# EAGLE design alu1 (EAGLE 5.11)

## Sheet 1 of 3
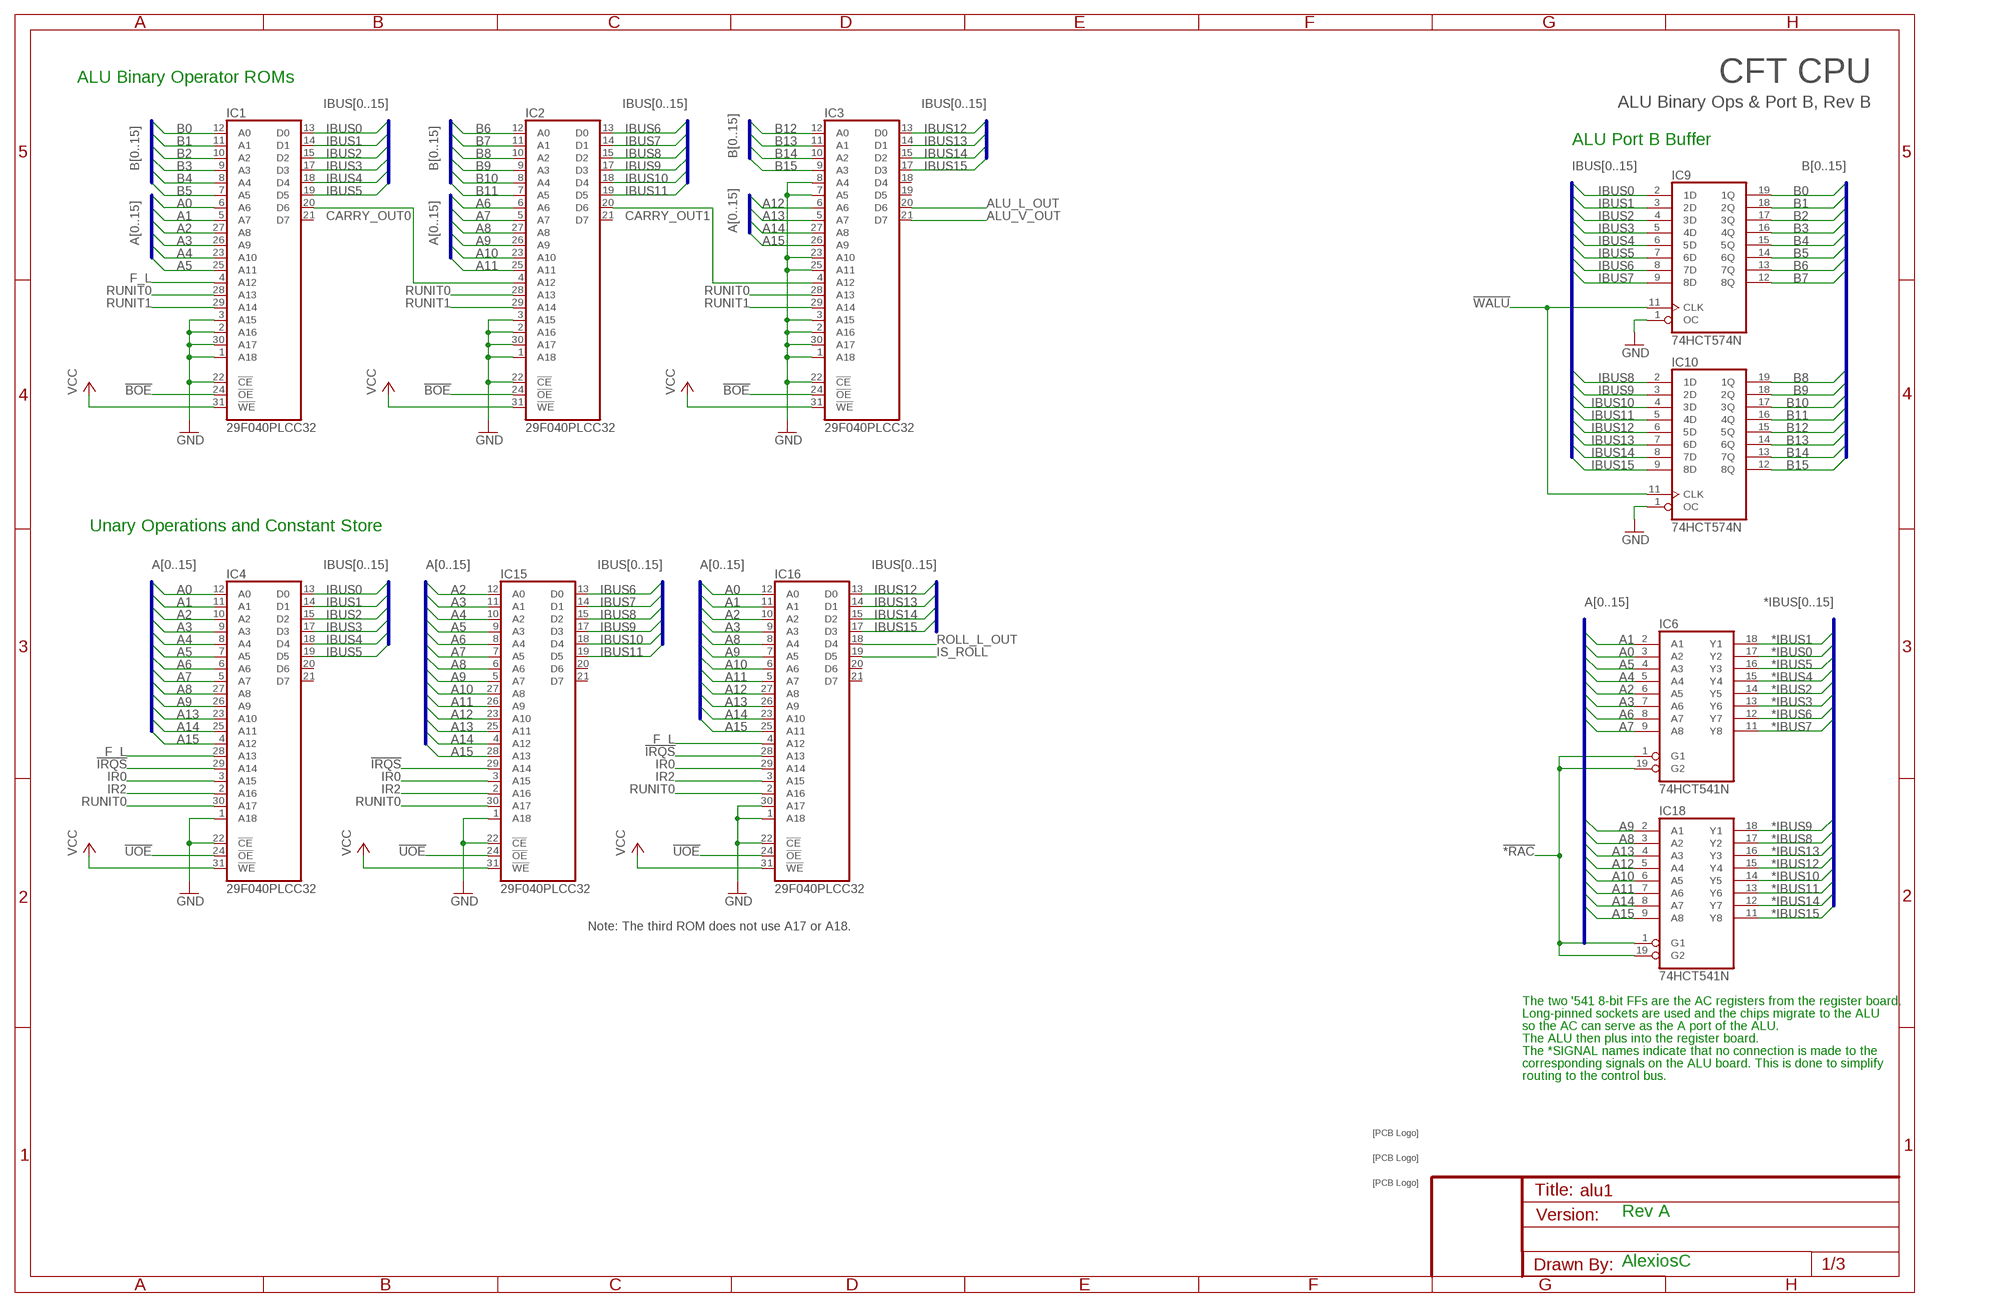
[diagram p0: schematic, sheet 1]

### Parts
IC1  29F040PLCC32  [PLCC32]
IC2  29F040PLCC32  [PLCC32]
IC3  29F040PLCC32  [PLCC32]
IC4  29F040PLCC32  [PLCC32]
IC6  74HCT541N  [DIL20]
IC9  74HCT574N  [DIL20]
IC10  74HCT574N  [DIL20]
IC15  29F040PLCC32  [PLCC32]
IC16  29F040PLCC32  [PLCC32]
IC18  74HCT541N  [DIL20]
U$1  SIGNATUREPLANE  [SIGNATURE_PLANE]
U$2  SIGNATUREPLANE  [SIGNATURE_PLANE]
U$3  SIGNATURESILK  [SIGNATURE]

### Nets
!*RAC: IC6.1(G1) IC6.19(G2) IC18.1(G1) IC18.19(G2)
!BOE: IC1.24(!OE) IC2.24(!OE) IC3.24(!OE) ; also sheet 2
!IRQS: IC4.29(A14) IC15.29(A14) IC16.28(A13) ; also sheet 3
!UOE: IC4.24(!OE) IC15.24(!OE) IC16.24(!OE) ; also sheet 2
!WALU: IC9.11(CLK) IC10.11(CLK) ; also sheet 3
*IBUS0: IC6.17(Y2)
*IBUS1: IC6.18(Y1)
*IBUS2: IC6.14(Y5)
*IBUS3: IC6.13(Y6)
*IBUS4: IC6.15(Y4)
*IBUS5: IC6.16(Y3)
*IBUS6: IC6.12(Y7)
*IBUS7: IC6.11(Y8)
*IBUS8: IC18.17(Y2)
*IBUS9: IC18.18(Y1)
*IBUS10: IC18.14(Y5)
*IBUS11: IC18.13(Y6)
*IBUS12: IC18.15(Y4)
*IBUS13: IC18.16(Y3)
*IBUS14: IC18.12(Y7)
*IBUS15: IC18.11(Y8)
A0: IC1.6(A6) IC4.12(A0) IC6.3(A2) IC16.12(A0)
A1: IC1.5(A7) IC4.11(A1) IC6.2(A1) IC16.11(A1)
A2: IC1.27(A8) IC4.10(A2) IC6.6(A5) IC15.12(A0) IC16.10(A2)
A3: IC1.26(A9) IC4.9(A3) IC6.7(A6) IC15.11(A1) IC16.9(A3)
A4: IC1.23(A10) IC4.8(A4) IC6.5(A4) IC15.10(A2)
A5: IC1.25(A11) IC4.7(A5) IC6.4(A3) IC15.9(A3)
A6: IC2.6(A6) IC4.6(A6) IC6.8(A7) IC15.8(A4)
A7: IC2.5(A7) IC4.5(A7) IC6.9(A8) IC15.7(A5)
A8: IC2.27(A8) IC4.27(A8) IC15.6(A6) IC16.8(A4) IC18.3(A2)
A9: IC2.26(A9) IC4.26(A9) IC15.5(A7) IC16.7(A5) IC18.2(A1)
A10: IC2.23(A10) IC15.27(A8) IC16.6(A6) IC18.6(A5)
A11: IC2.25(A11) IC15.26(A9) IC16.5(A7) IC18.7(A6)
A12: IC3.6(A6) IC15.23(A10) IC16.27(A8) IC18.5(A4)
A13: IC3.5(A7) IC4.23(A10) IC15.25(A11) IC16.26(A9) IC18.4(A3)
A14: IC3.27(A8) IC4.25(A11) IC15.4(A12) IC16.23(A10) IC18.8(A7)
A15: IC3.26(A9) IC4.4(A12) IC15.28(A13) IC16.25(A11) IC18.9(A8)
ALU_L_OUT: IC3.20(D6)
ALU_V_OUT: IC3.21(D7) ; also sheet 2
B0: IC1.12(A0) IC9.19(1Q)
B1: IC1.11(A1) IC9.18(2Q)
B2: IC1.10(A2) IC9.17(3Q)
B3: IC1.9(A3) IC9.16(4Q)
B4: IC1.8(A4) IC9.15(5Q)
B5: IC1.7(A5) IC9.14(6Q)
B6: IC2.12(A0) IC9.13(7Q)
B7: IC2.11(A1) IC9.12(8Q)
B8: IC2.10(A2) IC10.19(1Q)
B9: IC2.9(A3) IC10.18(2Q)
B10: IC2.8(A4) IC10.17(3Q)
B11: IC2.7(A5) IC10.16(4Q)
B12: IC3.12(A0) IC10.15(5Q)
B13: IC3.11(A1) IC10.14(6Q)
B14: IC3.10(A2) IC10.13(7Q)
B15: IC3.9(A3) IC10.12(8Q)
CARRY_OUT0: IC1.20(D6) IC2.4(A12)
CARRY_OUT1: IC2.20(D6) IC3.4(A12)
F_L: IC1.4(A12) IC4.28(A13) IC16.4(A12) ; also sheet 2
GND [Power]: IC1.1(A18) IC1.2(A16) IC1.3(A15) IC1.22(!CE) IC1.30(A17) IC2.1(A18) IC2.2(A16) IC2.3(A15) IC2.22(!CE) IC2.30(A17) IC3.1(A18) IC3.2(A16) IC3.3(A15) IC3.7(A5) IC3.8(A4) IC3.22(!CE) IC3.23(A10) IC3.25(A11) IC3.30(A17) IC4.1(A18) IC4.22(!CE) IC9.1(OC) IC10.1(OC) IC15.1(A18) IC15.22(!CE) IC16.1(A18) IC16.22(!CE) IC16.30(A17) ; also sheet 2,3
IBUS0: IC1.13(D0) IC4.13(D0) IC9.2(1D) ; also sheet 3
IBUS1: IC1.14(D1) IC4.14(D1) IC9.3(2D) ; also sheet 3
IBUS2: IC1.15(D2) IC4.15(D2) IC9.4(3D) ; also sheet 3
IBUS3: IC1.17(D3) IC4.17(D3) IC9.5(4D) ; also sheet 3
IBUS4: IC1.18(D4) IC4.18(D4) IC9.6(5D) ; also sheet 3
IBUS5: IC1.19(D5) IC4.19(D5) IC9.7(6D) ; also sheet 3
IBUS6: IC2.13(D0) IC9.8(7D) IC15.13(D0) ; also sheet 3
IBUS7: IC2.14(D1) IC9.9(8D) IC15.14(D1) ; also sheet 3
IBUS8: IC2.15(D2) IC10.2(1D) IC15.15(D2) ; also sheet 3
IBUS9: IC2.17(D3) IC10.3(2D) IC15.17(D3) ; also sheet 3
IBUS10: IC2.18(D4) IC10.4(3D) IC15.18(D4) ; also sheet 3
IBUS11: IC2.19(D5) IC10.5(4D) IC15.19(D5) ; also sheet 3
IBUS12: IC3.13(D0) IC10.6(5D) IC16.13(D0) ; also sheet 3
IBUS13: IC3.14(D1) IC10.7(6D) IC16.14(D1) ; also sheet 3
IBUS14: IC3.15(D2) IC10.8(7D) IC16.15(D2) ; also sheet 3
IBUS15: IC3.17(D3) IC10.9(8D) IC16.17(D3) ; also sheet 3
IR0: IC4.3(A15) IC15.3(A15) IC16.29(A14) ; also sheet 3
IR2: IC4.2(A16) IC15.2(A16) IC16.3(A15) ; also sheet 3
IS_ROLL: IC16.19(D5) ; also sheet 2
ROLL_L_OUT: IC16.18(D4) ; also sheet 2
RUNIT0: IC1.28(A13) IC2.28(A13) IC3.28(A13) IC4.30(A17) IC15.30(A17) IC16.2(A16) ; also sheet 2,3
RUNIT1: IC1.29(A14) IC2.29(A14) IC3.29(A14) ; also sheet 2,3
VCC [Power]: IC1.31(!WE) IC2.31(!WE) IC3.31(!WE) IC4.31(!WE) IC15.31(!WE) IC16.31(!WE) ; also sheet 2,3
Unconnected: IC1.21(D7) IC2.21(D7) IC3.18(D4) IC3.19(D5) IC4.20(D6) IC4.21(D7) IC15.20(D6) IC15.21(D7) IC16.20(D6) IC16.21(D7)

### Buses
IBUS[0..15]
A[0..15]
B[0..15]
AC[0..15]
*IBUS[0..15]

### Notes on the sheet
- ALU Binary Operator ROMs | CFT CPU
- ALU Binary Ops & Port B, Rev B
- ALU Port B Buffer
- Unary Operations and Constant Store
- Note: The third ROM does not use A17 or A18.
- The two '541 8-bit FFs are the AC registers from the register board.
- Long-pinned sockets are used and the chips migrate to the ALU
- so the AC can serve as the A port of the ALU.
- The ALU then plus into the register board.
- The *SIGNAL names indicate that no connection is made to the
- corresponding signals on the ALU board. This is done to simplify
- routing to the control bus.
- Rev A
- AlexiosC

## Sheet 2 of 3
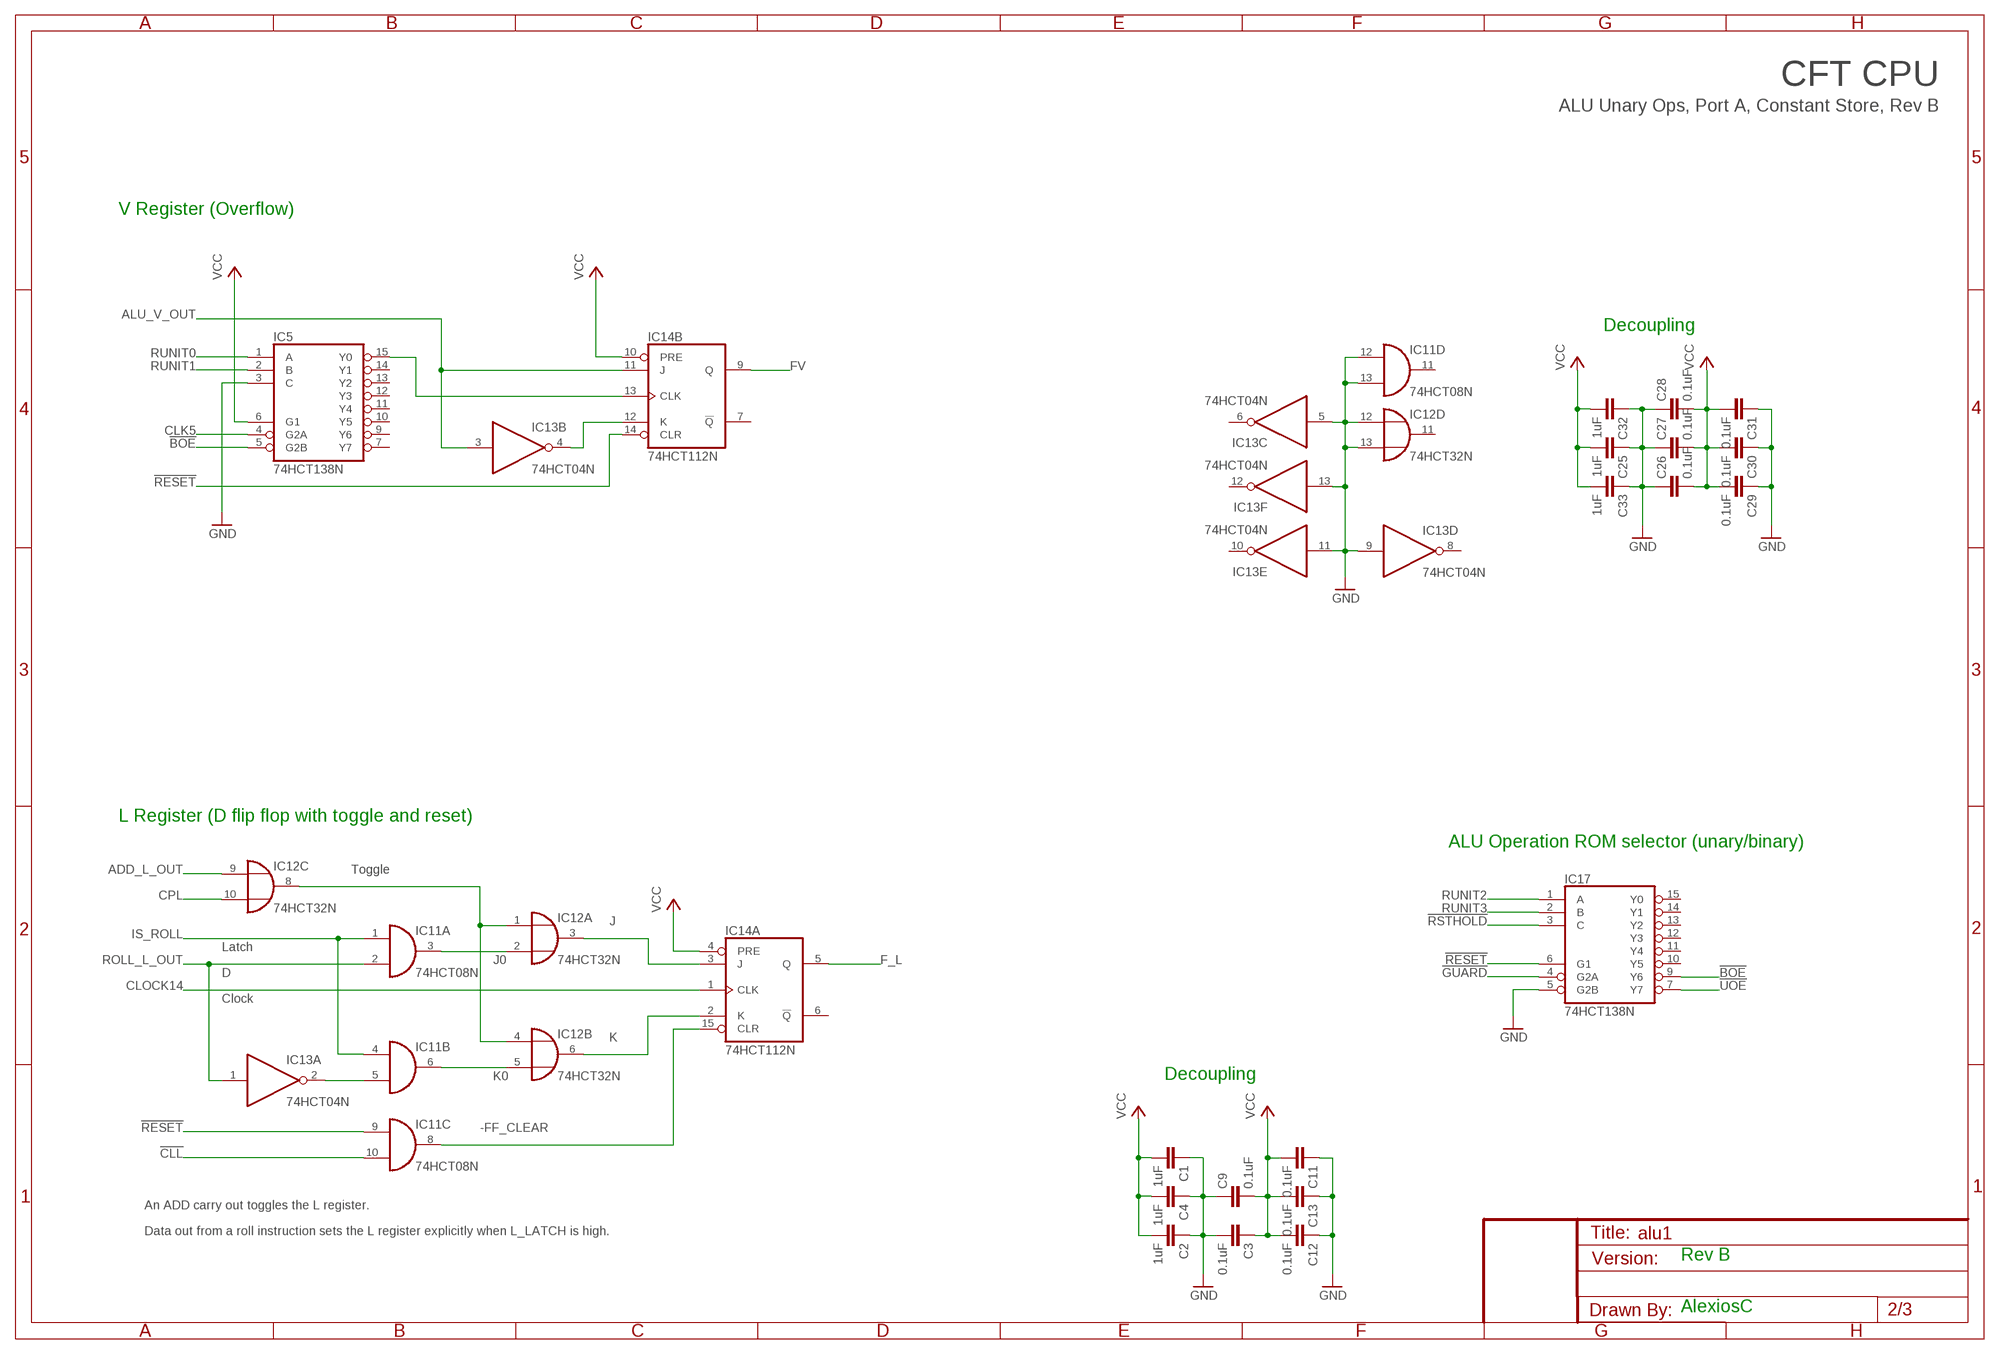
[diagram p1: schematic, sheet 2]

### Parts
C1  1uF  C-EU025-025X050  [C025-025X050]
C2  1uF  C-EU025-025X050  [C025-025X050]
C3  0.1uF  C-EU025-025X050  [C025-025X050]
C4  1uF  C-EU025-025X050  [C025-025X050]
C9  0.1uF  C-EU025-025X050  [C025-025X050]
C11  0.1uF  C-EU025-025X050  [C025-025X050]
C12  0.1uF  C-EU025-025X050  [C025-025X050]
C13  0.1uF  C-EU025-025X050  [C025-025X050]
C25  1uF  C-EU025-025X050  [C025-025X050]
C26  0.1uF  C-EU025-025X050  [C025-025X050]
C27  0.1uF  C-EU025-025X050  [C025-025X050]
C28  0.1uF  C-EU025-025X050  [C025-025X050]
C29  0.1uF  C-EU025-025X050  [C025-025X050]
C30  0.1uF  C-EU025-025X050  [C025-025X050]
C31  0.1uF  C-EU025-025X050  [C025-025X050]
C32  1uF  C-EU025-025X050  [C025-025X050]
C33  1uF  C-EU025-025X050  [C025-025X050]
IC5  74HCT138N  [DIL16]
IC11  74HCT08N  [DIL14]
IC12  74HCT32N  [DIL14]
IC13  74HCT04N  [DIL14]
IC14  74HCT112N  [DIL16]
IC17  74HCT138N  [DIL16]

### Nets
!BOE: IC5.5(G2B) IC17.9(Y6) ; also sheet 1
!CLL: IC11.10(C:I1) ; also sheet 3
!GUARD: IC17.4(G2A) ; also sheet 3
!RESET: IC11.9(C:I0) IC14.14(B:CLR) IC17.6(G1) ; also sheet 3
!RSTHOLD: IC17.3(C) ; also sheet 3
!UOE: IC17.7(Y7) ; also sheet 1
-FF_CLEAR: IC11.8(C:O) IC14.15(A:CLR)
ADD_L_OUT: IC12.9(C:I0)
ALU_V_OUT: IC13.3(B:I) IC14.11(B:J) ; also sheet 1
CLK5: IC5.4(G2A) ; also sheet 3
CLOCK14: IC14.1(A:CLK)
CPL: IC12.10(C:I1)
F_L: IC14.5(A:Q) ; also sheet 1
FV: IC14.9(B:Q) ; also sheet 3
GND [Power]: C1.1 C2.1 C3.2 C4.1 C9.1 C11.1 C12.1 C13.1 C25.1 C26.1 C27.1 C28.1 C29.1 C30.1 C31.1 C32.1 C33.1 IC5.3(C) IC11.12(D:I0) IC11.13(D:I1) IC12.12(D:I0) IC12.13(D:I1) IC13.5(C:I) IC13.9(D:I) IC13.11(E:I) IC13.13(F:I) IC17.5(G2B) ; also sheet 1,3
IS_ROLL: IC11.1(A:I0) IC11.4(B:I0) ; also sheet 1
J: IC12.3(A:O) IC14.3(A:J)
J0: IC11.3(A:O) IC12.2(A:I1)
K: IC12.6(B:O) IC14.2(A:K)
K0: IC11.6(B:O) IC12.5(B:I1)
L_TOGGLE: IC12.1(A:I0) IC12.4(B:I0) IC12.8(C:O)
N$1: IC5.15(Y0) IC14.13(B:CLK)
N$2: IC13.4(B:O) IC14.12(B:K)
N$3: IC11.5(B:I1) IC13.2(A:O)
ROLL_L_OUT: IC11.2(A:I1) IC13.1(A:I) ; also sheet 1
RUNIT0: IC5.1(A) ; also sheet 1,3
RUNIT1: IC5.2(B) ; also sheet 1,3
RUNIT2: IC17.1(A) ; also sheet 3
RUNIT3: IC17.2(B) ; also sheet 3
VCC [Power]: C1.2 C2.2 C3.1 C4.2 C9.2 C11.2 C12.2 C13.2 C25.2 C26.2 C27.2 C28.2 C29.2 C30.2 C31.2 C32.2 C33.2 IC5.6(G1) IC14.4(A:PRE) IC14.10(B:PRE) ; also sheet 1,3
Unconnected: IC5.7(Y7) IC5.9(Y6) IC5.10(Y5) IC5.11(Y4) IC5.12(Y3) IC5.13(Y2) IC5.14(Y1) IC11.11(D:O) IC12.11(D:O) IC13.6(C:O) IC13.8(D:O) IC13.10(E:O) IC13.12(F:O) IC14.6(A:!Q) IC14.7(B:!Q) IC17.10(Y5) IC17.11(Y4) IC17.12(Y3) IC17.13(Y2) IC17.14(Y1) IC17.15(Y0)

### Notes on the sheet
- CFT CPU
- ALU Unary Ops, Port A, Constant Store, Rev B
- V Register (Overflow)
- Decoupling
- L Register (D flip flop with toggle and reset)
- ALU Operation ROM selector (unary/binary)
- Toggle
- Latch
- D
- Clock
- Decoupling
- An ADD carry out toggles the L register.
- Data out from a roll instruction sets the L register explicitly when L_LATCH is high.
- Rev B
- AlexiosC

## Sheet 3 of 3
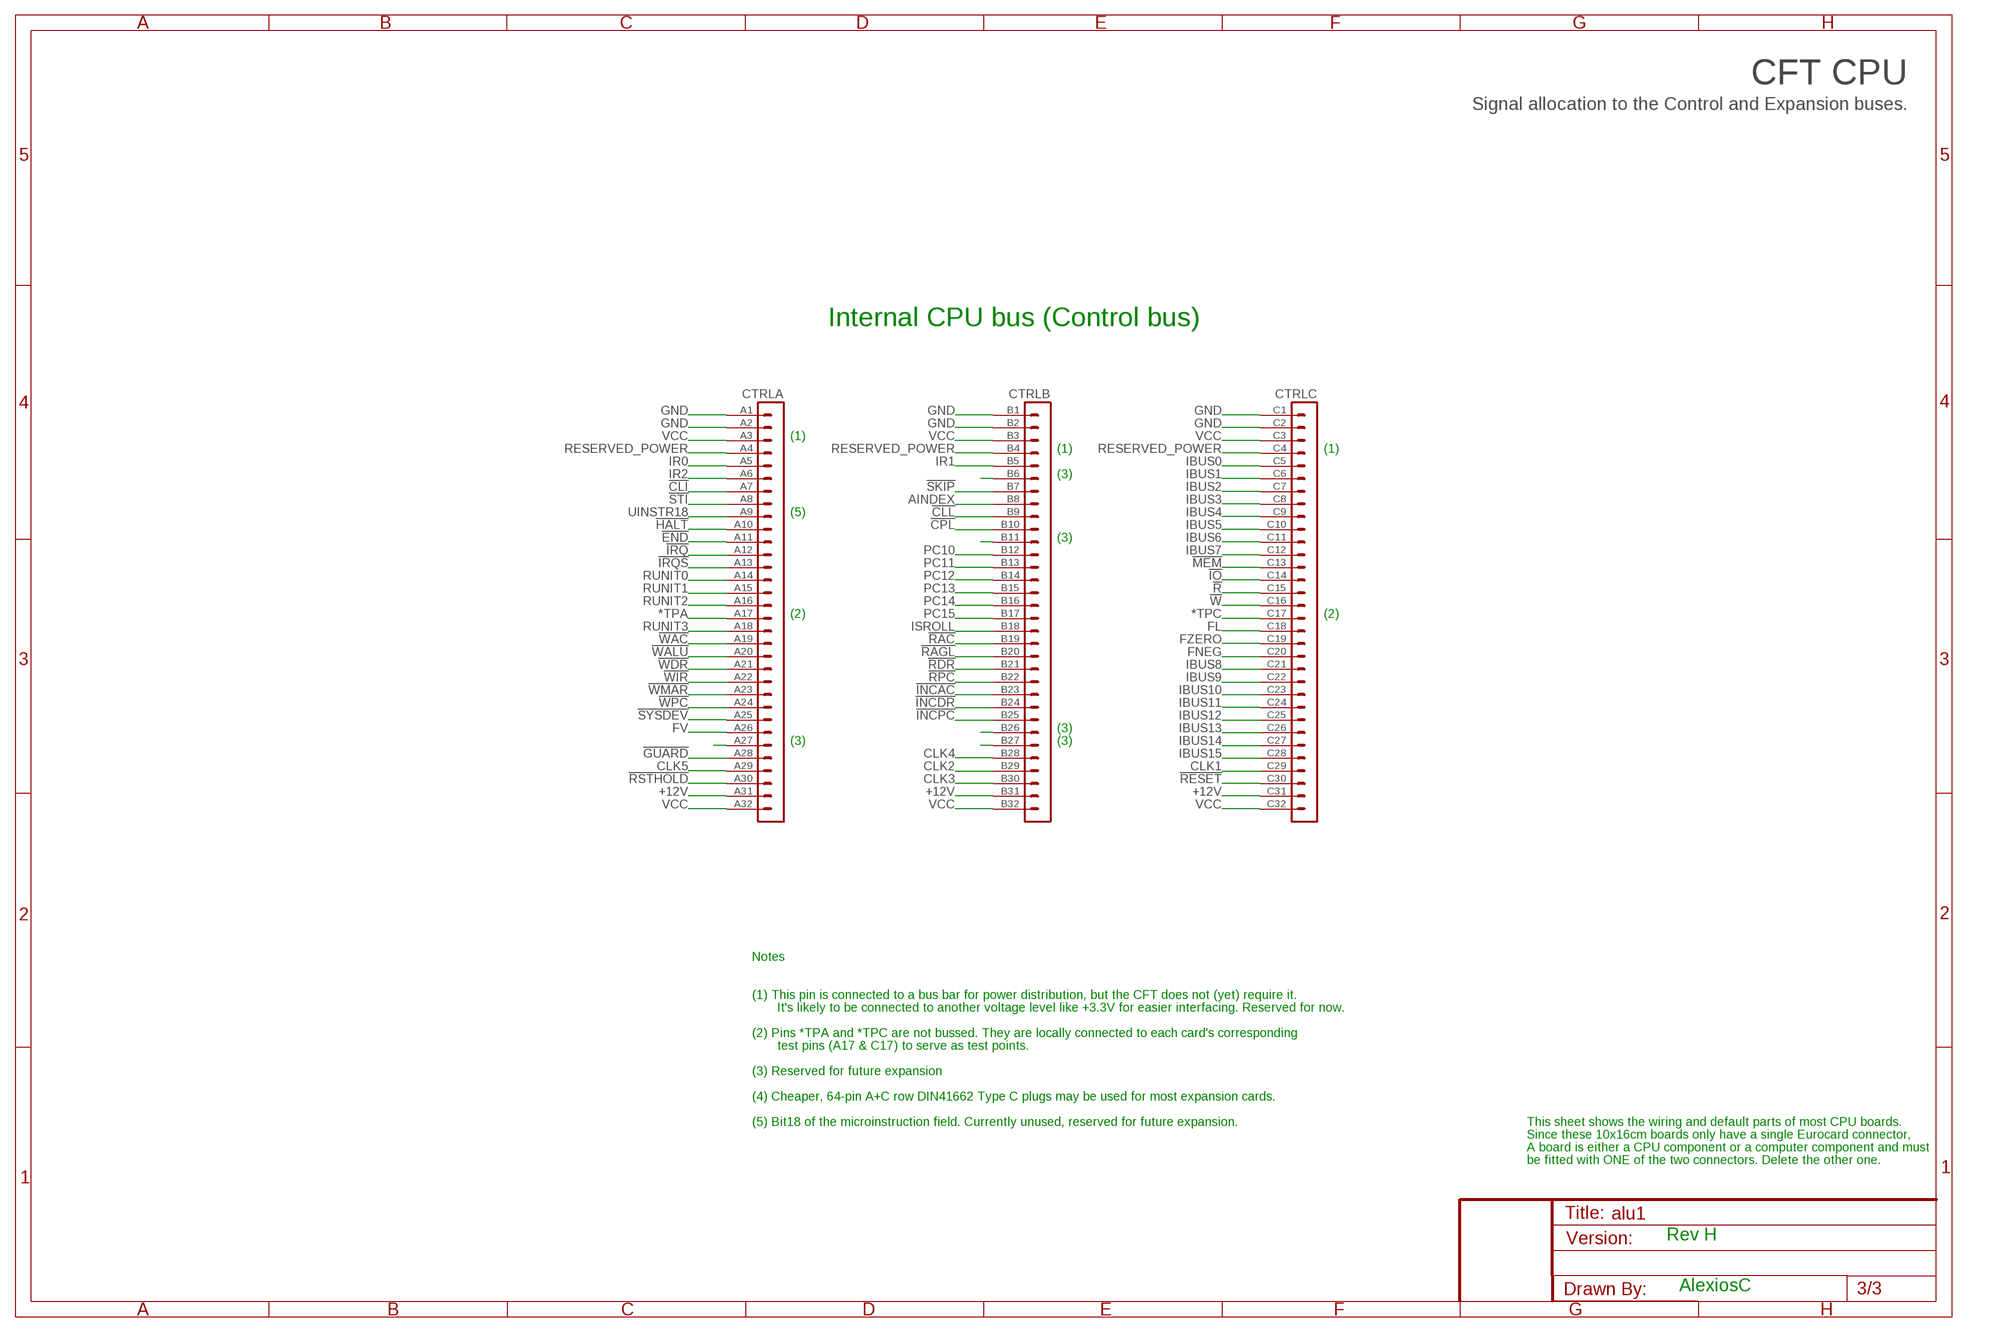
[diagram p2: schematic, sheet 3]

### Parts
CTRL  VG96-3B  [VG96B]

### Nets
!CLI: CTRL.A7
!CLL: CTRL.B9 ; also sheet 2
!CPL: CTRL.B10
!END: CTRL.A11
!GUARD: CTRL.A28 ; also sheet 2
!HALT: CTRL.A10
!INCAC: CTRL.B23
!INCDR: CTRL.B24
!INCPC: CTRL.B25
!IO: CTRL.C14
!IRQ: CTRL.A12
!IRQS: CTRL.A13 ; also sheet 1
!MEM: CTRL.C13
!R: CTRL.C15
!RAC: CTRL.B19
!RAGL: CTRL.B20
!RDR: CTRL.B21
!RESET: CTRL.C30 ; also sheet 2
!RPC: CTRL.B22
!RSTHOLD: CTRL.A30 ; also sheet 2
!SKIP: CTRL.B7
!STI: CTRL.A8
!SYSDEV: CTRL.A25
!W: CTRL.C16
!WAC: CTRL.A19
!WALU: CTRL.A20 ; also sheet 1
!WDR: CTRL.A21
!WIR: CTRL.A22
!WMAR: CTRL.A23
!WPC: CTRL.A24
*TPA: CTRL.A17
*TPC: CTRL.C17
+12V [12V]: CTRL.A31 CTRL.B31 CTRL.C31
AINDEX: CTRL.B8
CLK1: CTRL.C29
CLK2: CTRL.B29
CLK3: CTRL.B30
CLK4: CTRL.B28
CLK5: CTRL.A29 ; also sheet 2
FL: CTRL.C18
FNEG: CTRL.C20
FV: CTRL.A26 ; also sheet 2
FZERO: CTRL.C19
GND [Power]: CTRL.A1 CTRL.A2 CTRL.B1 CTRL.B2 CTRL.C1 CTRL.C2 ; also sheet 1,2
IBUS0: CTRL.C5 ; also sheet 1
IBUS1: CTRL.C6 ; also sheet 1
IBUS2: CTRL.C7 ; also sheet 1
IBUS3: CTRL.C8 ; also sheet 1
IBUS4: CTRL.C9 ; also sheet 1
IBUS5: CTRL.C10 ; also sheet 1
IBUS6: CTRL.C11 ; also sheet 1
IBUS7: CTRL.C12 ; also sheet 1
IBUS8: CTRL.C21 ; also sheet 1
IBUS9: CTRL.C22 ; also sheet 1
IBUS10: CTRL.C23 ; also sheet 1
IBUS11: CTRL.C24 ; also sheet 1
IBUS12: CTRL.C25 ; also sheet 1
IBUS13: CTRL.C26 ; also sheet 1
IBUS14: CTRL.C27 ; also sheet 1
IBUS15: CTRL.C28 ; also sheet 1
IR0: CTRL.A5 ; also sheet 1
IR1: CTRL.B5
IR2: CTRL.A6 ; also sheet 1
ISROLL: CTRL.B18
N$13: CTRL.B27
N$21: CTRL.B6
N$22: CTRL.A27
N$23: CTRL.B26
N$47: CTRL.B11
PC10: CTRL.B12
PC11: CTRL.B13
PC12: CTRL.B14
PC13: CTRL.B15
PC14: CTRL.B16
PC15: CTRL.B17
RESERVED_POWER: CTRL.A4 CTRL.B4 CTRL.C4
RUNIT0: CTRL.A14 ; also sheet 1,2
RUNIT1: CTRL.A15 ; also sheet 1,2
RUNIT2: CTRL.A16 ; also sheet 2
RUNIT3: CTRL.A18 ; also sheet 2
UINSTR18: CTRL.A9
VCC [Power]: CTRL.A3 CTRL.A32 CTRL.B3 CTRL.B32 CTRL.C3 CTRL.C32 ; also sheet 1,2

### Notes on the sheet
- CFT CPU
- Signal allocation to the Control and Expansion buses.
- Internal CPU bus (Control bus)
- (1)
- (1) | (1)
- (3)
- (5)
- (3)
- (2) | (2)
- (3)
- (3) | (3)
- Notes
- (1) This pin is connected to a bus bar for power distribution, but the CFT does not (yet) require it.
- It's likely to be connected to another voltage level like +3.3V for easier interfacing. Reserved for now.
- (2) Pins *TPA and *TPC are not bussed. They are locally connected to each card's corresponding
- test pins (A17 & C17) to serve as test points.
- (3) Reserved for future expansion
- (4) Cheaper, 64-pin A+C row DIN41662 Type C plugs may be used for most expansion cards.
- (5) Bit18 of the microinstruction field. Currently unused, reserved for future expansion. | This sheet shows the wiring and default parts of most CPU boards.
- Since these 10x16cm boards only have a single Eurocard connector,
- A board is either a CPU component or a computer component and must
- be fitted with ONE of the two connectors. Delete the other one.
- Rev H
- AlexiosC

## Power pins joined to a net without a drawn wire
GND: IC1.16(GND) IC2.16(GND) IC3.16(GND) IC4.16(GND) IC5.8(GND) IC6.10(GND) IC9.10(GND) IC10.10(GND) IC11.7(P:GND) IC12.7(P:GND) IC13.7(P:GND) IC14.8(P:GND) IC15.16(GND) IC16.16(GND) IC17.8(GND) IC18.10(GND)
VCC: IC1.32(VCC) IC2.32(VCC) IC3.32(VCC) IC4.32(VCC) IC5.16(VCC) IC6.20(VCC) IC9.20(VCC) IC10.20(VCC) IC11.14(P:VCC) IC12.14(P:VCC) IC13.14(P:VCC) IC14.16(P:VCC) IC15.32(VCC) IC16.32(VCC) IC17.16(VCC) IC18.20(VCC)

## Library data of the parts
C1-C4 C9 C11-C13 C25-C33 = rcl:C-EU: CAPACITOR, European symbol
CTRL = 19inch:VG96-3: PCB EUROCARD, 96-pin type C/ABC, 2.54 mm
IC1-IC4 IC15 IC16 = alexios:29F040: 4-mbit (512x8) Flash memory in a PLCC32 package (with socket). AM29F040 is an example of this.
IC5 IC17 = 74xx-eu:74*138: 3-line to 8-line DECODER/DEMULTIPLEXER
IC6 IC18 = 74xx-eu:74*541: Octal BUFFER and LINE DRIVER, 3-state
IC9 IC10 = 74xx-eu:74*574: 8-bit D type FLIP FLOP bus driver
IC11 = 74xx-eu:74*08: Quad 2-input AND gate
IC12 = 74xx-eu:74*32: Quad 2-input OR gate
IC13 = 74xx-eu:74*04: Hex INVERTER
IC14 = 74xx-eu:74*112: Dual J-K negative edge triggered FLIP FLOP, preset and clear
U$1-U$3 = alexios:SIGNATURE: Soup signature

## Net classes
0 default: width 0.305 mm, clearance 0.305 mm
1 Power: width 0.914 mm, clearance 0.254 mm
2 12V: width 0.635 mm, clearance 0.635 mm

## Board
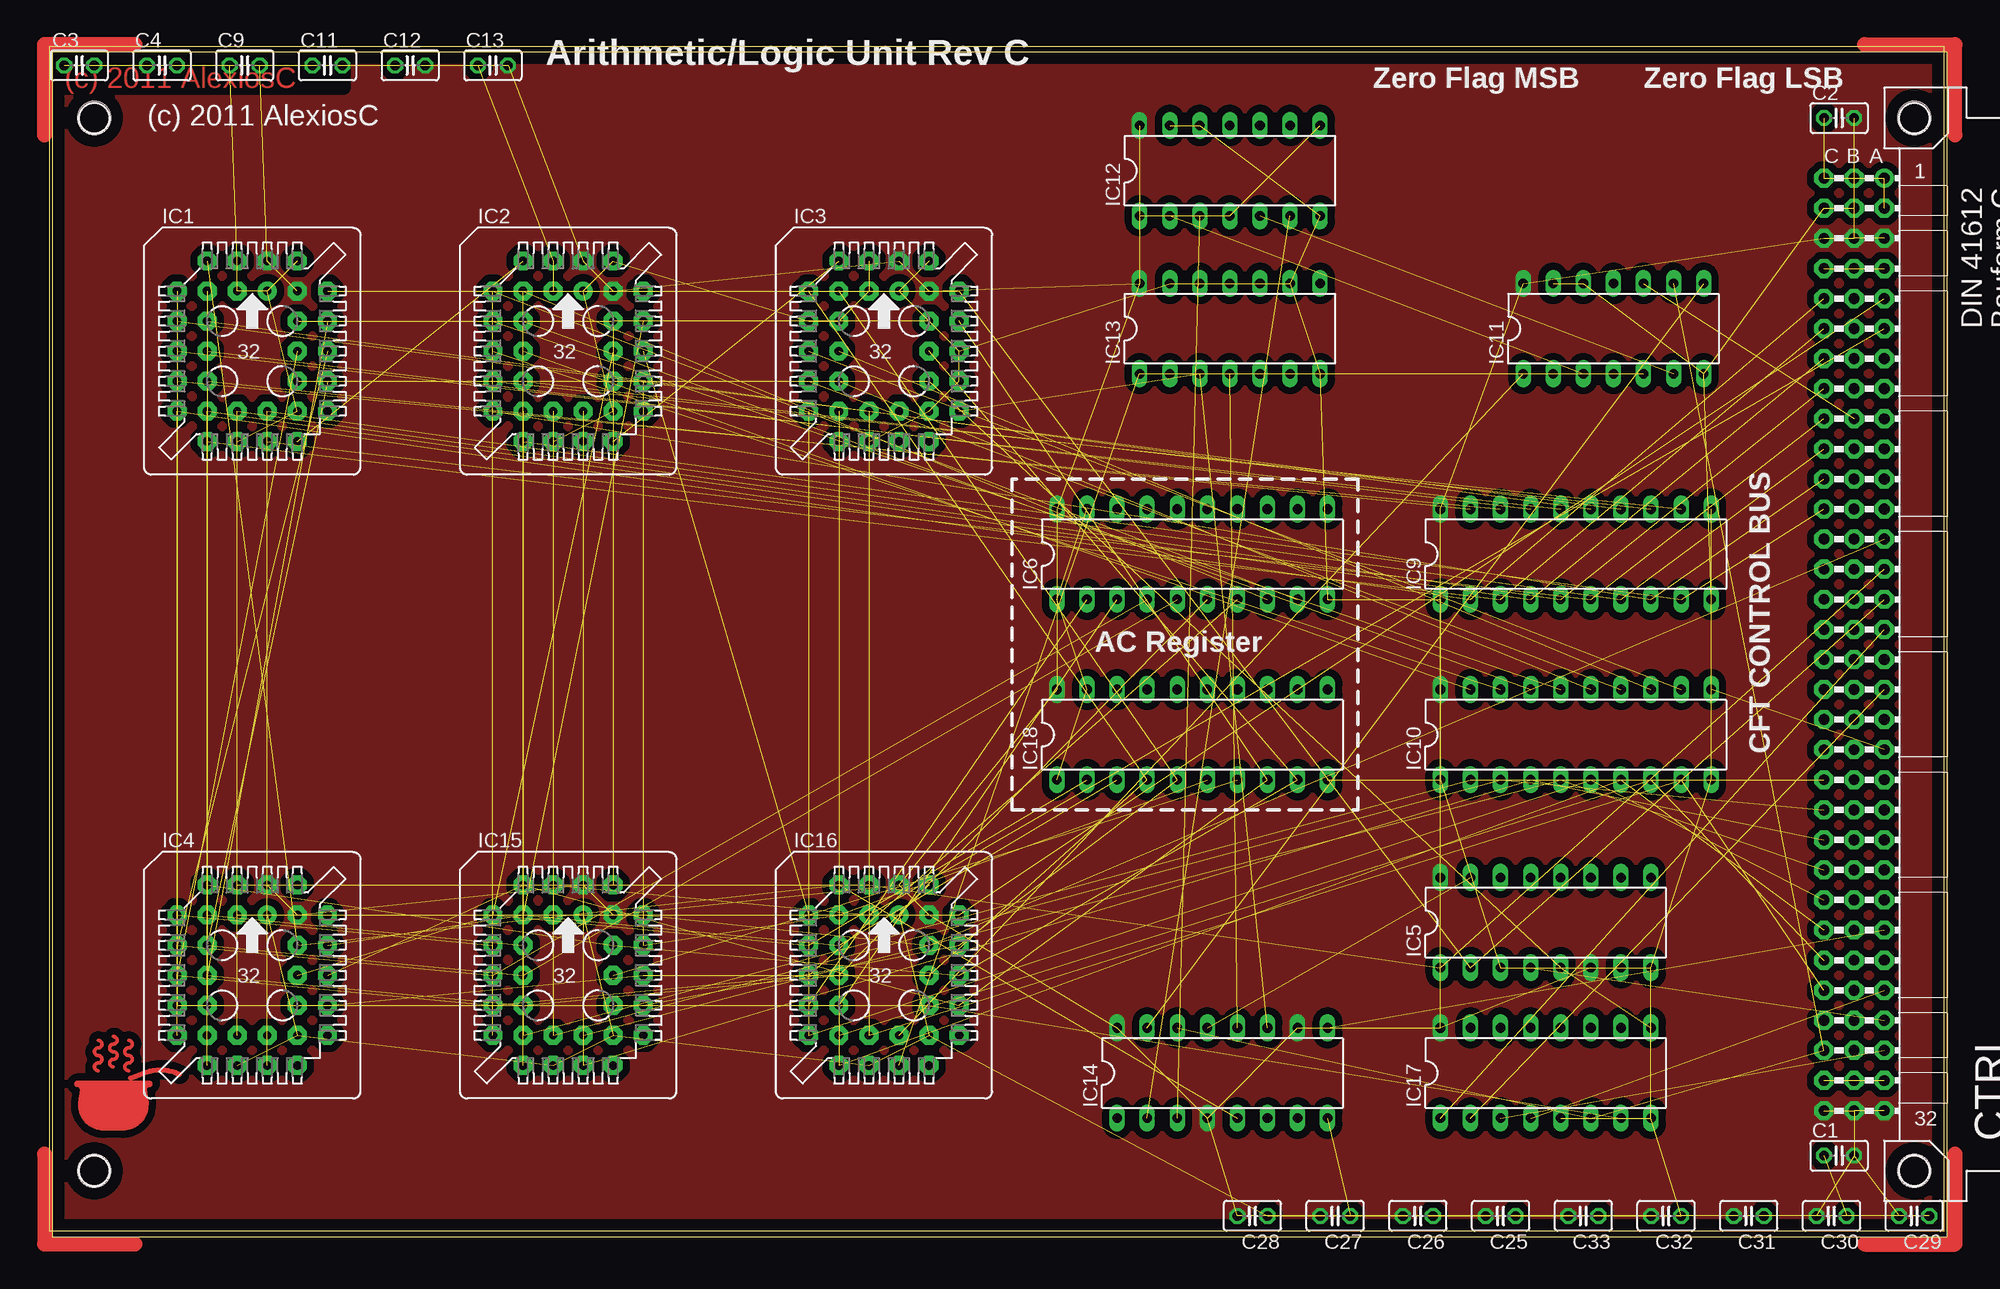
[diagram p3: board, top side]
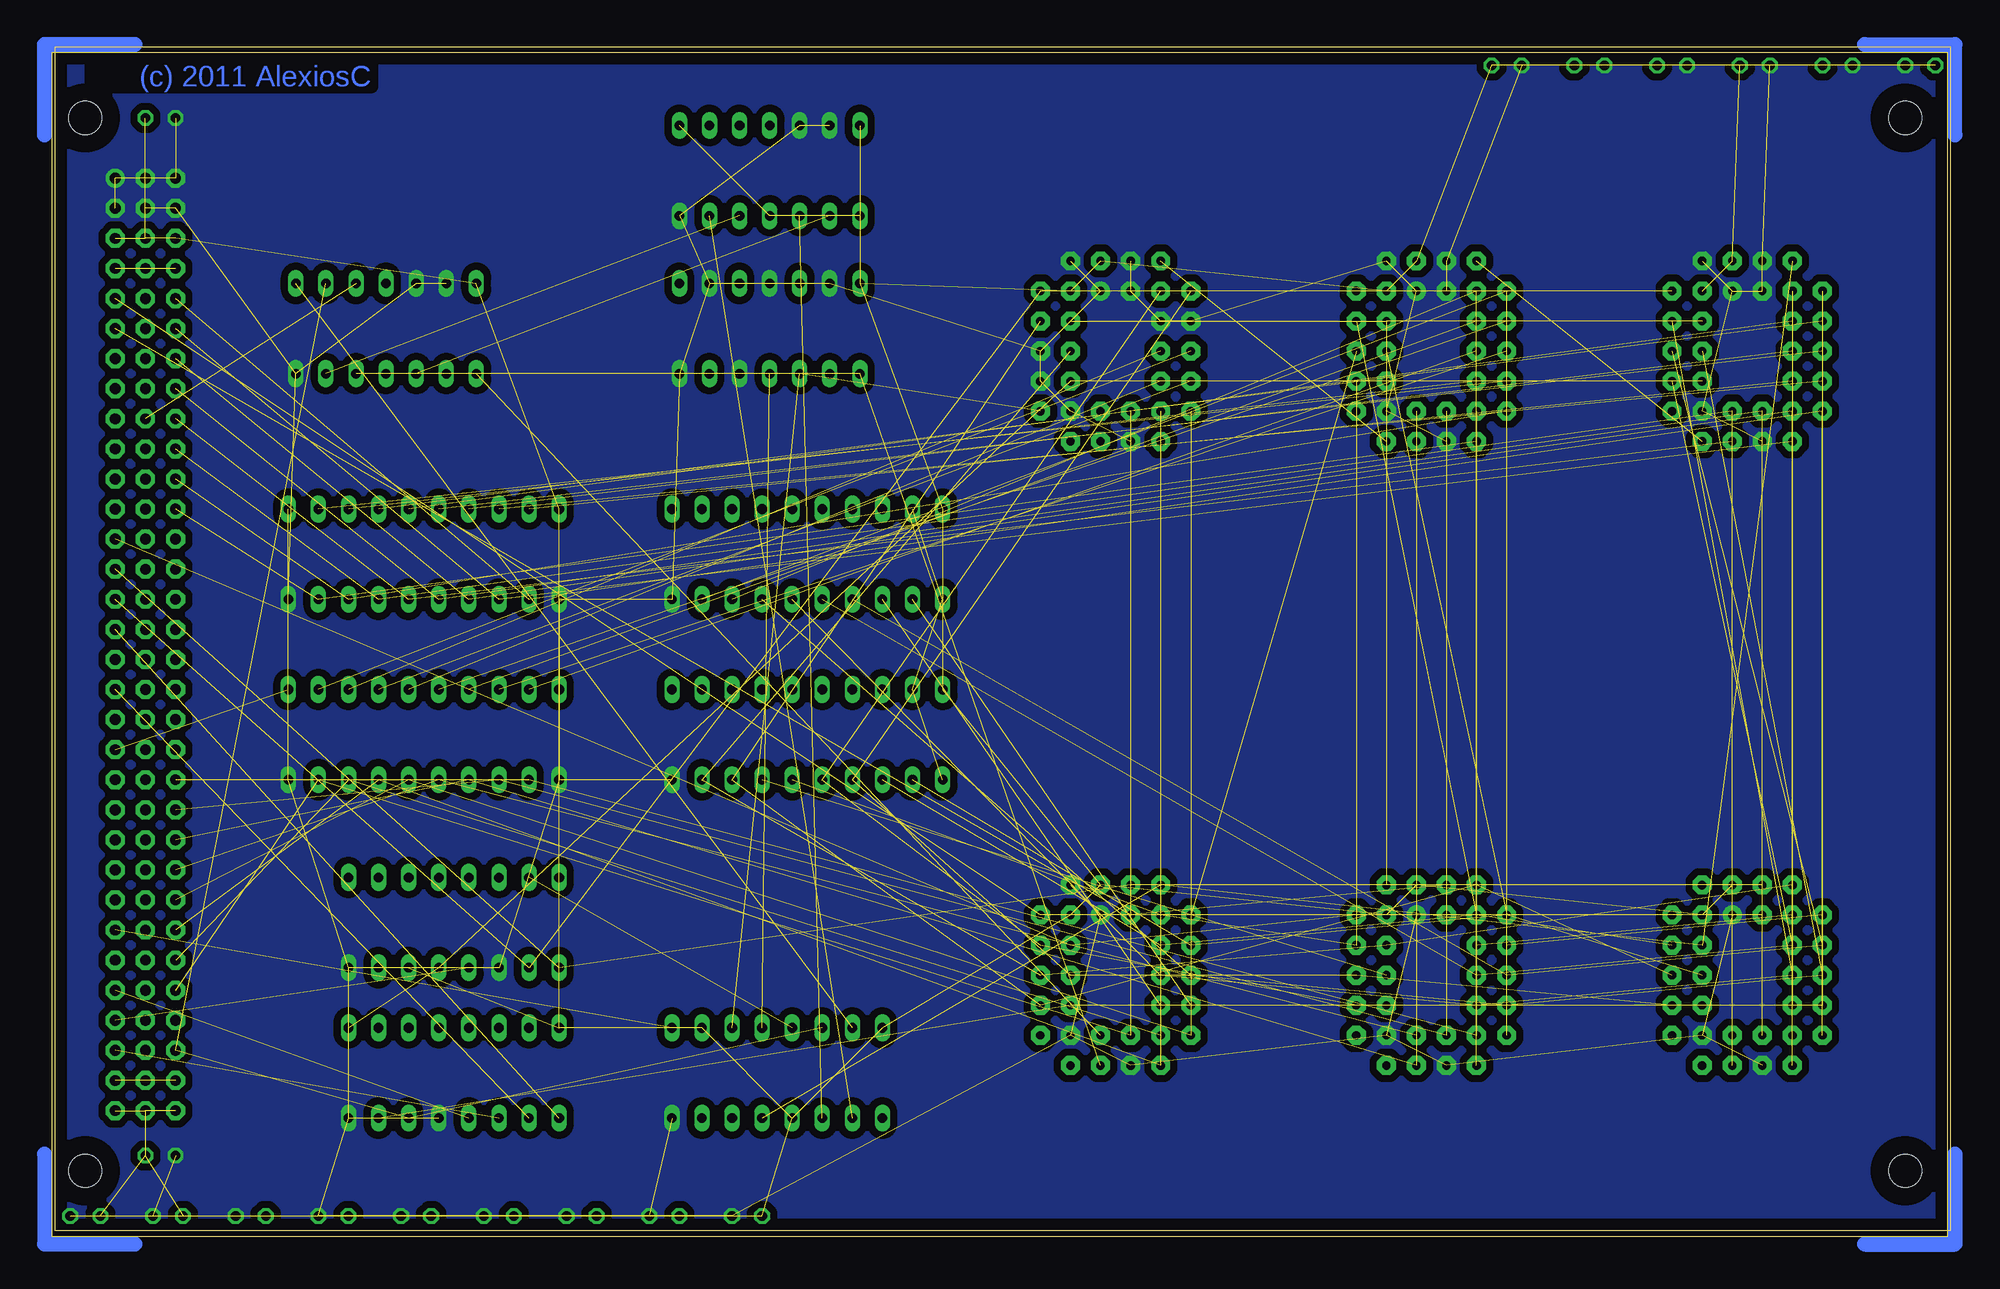
[diagram p4: board, bottom side, seen from below]

Size 160 x 100 mm. Coordinates in mm from the lower left corner, seen from the top.
Outline: 0,0 160,0 160,100 0,100 0,0
Copper layers (1*16): Top 0.035mm / dielectric 1.5mm / Bottom 0.035mm
Design rules "cft-olimex-10mil": minimum track width 10mil, minimum drill 24mil, track to track 10mil, track to pad 10mil, pad to pad 10mil, via to via 10mil, smd to smd 10mil, copper to edge 40mil, drill to drill 10mil, minimum pad ring 10mil, minimum via ring 10mil, stop-mask expansion 0mil, vias tented up to drill 10mil, thermal gap 10mil

### Footprints (pad centres in the part's own frame; a part is rotated, then mirrored left to right if it is on the bottom)
C025-025X050 = drill 0.813 octagon: 1 -1.27,0; 2 1.27,0
VG96B = drill 0.914 pad 1.6 round: A1 154.94,39.37 | drill 0.914 pad 1.6 octagon: A2 154.94,36.83; A3 154.94,34.29; A4 154.94,31.75; A5 154.94,29.21; A6 154.94,26.67; A7 154.94,24.13; A8 154.94,21.59; A9 154.94,19.05; A10 154.94,16.51; A11 154.94,13.97; A12 154.94,11.43; A13 154.94,8.89; A14 154.94,6.35; A15 154.94,3.81; A16 154.94,1.27; A17 154.94,-1.27; A18 154.94,-3.81; A19 154.94,-6.35; A20 154.94,-8.89; A21 154.94,-11.43; A22 154.94,-13.97; A23 154.94,-16.51; A24 154.94,-19.05; A25 154.94,-21.59; A26 154.94,-24.13; A27 154.94,-26.67; A28 154.94,-29.21; A29 154.94,-31.75; A30 154.94,-34.29; A31 154.94,-36.83; A32 154.94,-39.37; B1 152.4,39.37; B2 152.4,36.83; B3 152.4,34.29; B4 152.4,31.75; B5 152.4,29.21; B6 152.4,26.67; B7 152.4,24.13; B8 152.4,21.59; B9 152.4,19.05; B10 152.4,16.51; B11 152.4,13.97; B12 152.4,11.43; B13 152.4,8.89; B14 152.4,6.35; B15 152.4,3.81; B16 152.4,1.27; B17 152.4,-1.27; B18 152.4,-3.81; B19 152.4,-6.35; B20 152.4,-8.89; B21 152.4,-11.43; B22 152.4,-13.97; B23 152.4,-16.51; B24 152.4,-19.05; B25 152.4,-21.59; B26 152.4,-24.13; B27 152.4,-26.67; B28 152.4,-29.21; B29 152.4,-31.75; B30 152.4,-34.29; B31 152.4,-36.83; B32 152.4,-39.37; C1 149.86,39.37; C2 149.86,36.83; C3 149.86,34.29; C4 149.86,31.75; C5 149.86,29.21; C6 149.86,26.67; C7 149.86,24.13; C8 149.86,21.59; C9 149.86,19.05; C10 149.86,16.51; C11 149.86,13.97; C12 149.86,11.43; C13 149.86,8.89; C14 149.86,6.35; C15 149.86,3.81; C16 149.86,1.27; C17 149.86,-1.27; C18 149.86,-3.81; C19 149.86,-6.35; C20 149.86,-8.89; C21 149.86,-11.43; C22 149.86,-13.97; C23 149.86,-16.51; C24 149.86,-19.05; C25 149.86,-21.59; C26 149.86,-24.13; C27 149.86,-26.67; C28 149.86,-29.21; C29 149.86,-31.75; C30 149.86,-34.29; C31 149.86,-36.83; C32 149.86,-39.37 | hole 2.794: 157.48,44.45; 157.48,-44.45; 3.81,44.45; 3.81,-44.45
PLCC32 = drill 0.7 pad 1.6 round: 1 1.27,5.08 | drill 0.7 pad 1.6 octagon: 2 -1.27,7.62; 3 -1.27,5.08; 4 -3.81,7.62; 5 -6.35,5.08; 6 -3.81,5.08; 7 -6.35,2.54; 8 -3.81,2.54; 9 -6.35,0; 10 -3.81,0; 11 -6.35,-2.54; 12 -3.81,-2.54; 13 -6.35,-5.08; 14 -3.81,-7.62; 15 -3.81,-5.08; 16 -1.27,-7.62; 17 -1.27,-5.08; 18 1.27,-7.62; 19 1.27,-5.08; 20 3.81,-7.62; 21 6.35,-5.08; 22 3.81,-5.08; 23 6.35,-2.54; 24 3.81,-2.54; 25 6.35,0; 26 3.81,0; 27 6.35,2.54; 28 3.81,2.54; 29 6.35,5.08; 30 3.81,7.62; 31 3.81,5.08; 32 1.27,7.62
DIL16 = drill 0.813 long: 1 -8.89,-3.81; 2 -6.35,-3.81; 3 -3.81,-3.81; 4 -1.27,-3.81; 5 1.27,-3.81; 6 3.81,-3.81; 7 6.35,-3.81; 8 8.89,-3.81; 9 8.89,3.81; 10 6.35,3.81; 11 3.81,3.81; 12 1.27,3.81; 13 -1.27,3.81; 14 -3.81,3.81; 15 -6.35,3.81; 16 -8.89,3.81
DIL20 = drill 0.813 long: 1 -11.43,-3.81; 2 -8.89,-3.81; 3 -6.35,-3.81; 4 -3.81,-3.81; 5 -1.27,-3.81; 6 1.27,-3.81; 7 3.81,-3.81; 8 6.35,-3.81; 9 8.89,-3.81; 10 11.43,-3.81; 11 11.43,3.81; 12 8.89,3.81; 13 6.35,3.81; 14 3.81,3.81; 15 1.27,3.81; 16 -1.27,3.81; 17 -3.81,3.81; 18 -6.35,3.81; 19 -8.89,3.81; 20 -11.43,3.81
DIL14 = drill 0.813 long: 1 -7.62,-3.81; 2 -5.08,-3.81; 3 -2.54,-3.81; 4 0,-3.81; 5 2.54,-3.81; 6 5.08,-3.81; 7 7.62,-3.81; 8 7.62,3.81; 9 5.08,3.81; 10 2.54,3.81; 11 0,3.81; 12 -2.54,3.81; 13 -5.08,3.81; 14 -7.62,3.81

### Placement (x,y rotation side)
C1  151.13,6.35 0 top
C2  151.13,93.98 0 top
C3  2.54,98.42 0 top
C4  9.53,98.42 0 top
C9  16.51,98.42 0 top
C11  23.5,98.42 0 top
C12  30.48,98.42 0 top
C13  37.47,98.42 0 top
C25  122.56,1.27 180 top
C26  115.57,1.27 180 top
C27  108.58,1.27 180 top
C28  101.6,1.27 180 top
C29  157.48,1.27 180 top
C30  150.5,1.27 180 top
C31  143.51,1.27 180 top
C32  136.53,1.27 180 top
C33  129.54,1.27 180 top
CTRL  0,49.53 0 top
IC1  17.14,74.3 0 top
IC2  43.81,74.3 0 top
IC3  70.48,74.3 0 top
IC4  17.14,21.59 0 top
IC5  126.36,26.04 0 top
IC6  96.52,57.15 0 top
IC9  128.91,57.15 0 top
IC10  128.91,41.91 0 top
IC11  132.08,76.2 0 top
IC12  99.69,89.53 0 top
IC13  99.69,76.2 0 top
IC14  99.06,13.34 0 top
IC15  43.81,21.59 0 top
IC16  70.48,21.59 0 top
IC17  126.36,13.34 0 top
IC18  96.52,41.91 0 top
U$1  2.54,8.26 0 top
U$2  0,104.78 0 top  (outside the outline)
U$3  13.34,104.14 0 top  (outside the outline)

### Tracks (layer width: path | path; a pad name or v marks a point on that pad's centre or on a via)
!*RAC  (3 unrouted)
!BOE  (4 unrouted)
!CLL  (1 unrouted)
!GUARD  (1 unrouted)
!IRQS  (3 unrouted)
!RESET  (3 unrouted)
!RSTHOLD  (1 unrouted)
!UOE  (3 unrouted)
!WALU  (2 unrouted)
+12V  (2 unrouted)
-FF_CLEAR  (1 unrouted)
A0  (3 unrouted)
A1  (3 unrouted)
A2  (4 unrouted)
A3  (4 unrouted)
A4  (3 unrouted)
A5  (3 unrouted)
A6  (3 unrouted)
A7  (3 unrouted)
A8  (4 unrouted)
A9  (4 unrouted)
A10  (3 unrouted)
A11  (3 unrouted)
A12  (3 unrouted)
A13  (4 unrouted)
A14  (4 unrouted)
A15  (4 unrouted)
ALU_V_OUT  (2 unrouted)
B0  (1 unrouted)
B1  (1 unrouted)
B2  (1 unrouted)
B3  (1 unrouted)
B4  (1 unrouted)
B5  (1 unrouted)
B6  (1 unrouted)
B7  (1 unrouted)
B8  (1 unrouted)
B9  (1 unrouted)
B10  (1 unrouted)
B11  (1 unrouted)
B12  (1 unrouted)
B13  (1 unrouted)
B14  (1 unrouted)
B15  (1 unrouted)
CARRY_OUT0  (1 unrouted)
CARRY_OUT1  (1 unrouted)
CLK5  (1 unrouted)
F_L  (3 unrouted)
FV  (1 unrouted)
GND  (76 unrouted)
  pour Bottom (isolate 0.61, no thermals): 0,0 160.02,0 160.02,99.06 0,99.06
IBUS0  (3 unrouted)
IBUS1  (3 unrouted)
IBUS2  (3 unrouted)
IBUS3  (3 unrouted)
IBUS4  (3 unrouted)
IBUS5  (3 unrouted)
IBUS6  (3 unrouted)
IBUS7  (3 unrouted)
IBUS8  (3 unrouted)
IBUS9  (3 unrouted)
IBUS10  (3 unrouted)
IBUS11  (3 unrouted)
IBUS12  (3 unrouted)
IBUS13  (3 unrouted)
IBUS14  (3 unrouted)
IBUS15  (3 unrouted)
IR0  (3 unrouted)
IR2  (3 unrouted)
IS_ROLL  (2 unrouted)
J  (1 unrouted)
J0  (1 unrouted)
K  (1 unrouted)
K0  (1 unrouted)
L_TOGGLE  (2 unrouted)
N$1  (1 unrouted)
N$2  (1 unrouted)
N$3  (1 unrouted)
RESERVED_POWER  (2 unrouted)
ROLL_L_OUT  (2 unrouted)
RUNIT0  (7 unrouted)
RUNIT1  (4 unrouted)
RUNIT2  (1 unrouted)
RUNIT3  (1 unrouted)
VCC  (47 unrouted)
  pour Top (isolate 0.61, no thermals): 0,0 160.02,0 160.02,100.33 0,100.33

### Text on the board
Top: (c) 2011 AlexiosC
Bottom: (c) 2011 AlexiosC
tNames: http://www.bedroomlan.org/cft | Arithmetic/Logic Unit Rev C | Zero Flag MSB | Zero Flag LSB | (c) 2011 AlexiosC | CFT CONTROL BUS | AC Register